# EAGLE schematic Interdigitated-Electrode-V2 (EAGLE 9.5.2)
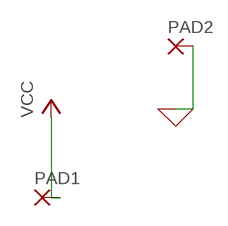
[diagram p0: schematic, sheet 1]

## Parts
PAD1  2,15/1,0  [2,15/1,0]
PAD2  2,15/1,0  [2,15/1,0]

## Nets
0: PAD2.1(P) ; supply symbol labelled GND
VCC: PAD1.1(P)

## Library data of the parts
PAD1 PAD2 = wirepad:2,15/1,0: THROUGH-HOLE PAD